# Altium schematic sheet LO_Synthetiser.SchDoc
size A4; SheetNumber: 1; SheetTotal: 4
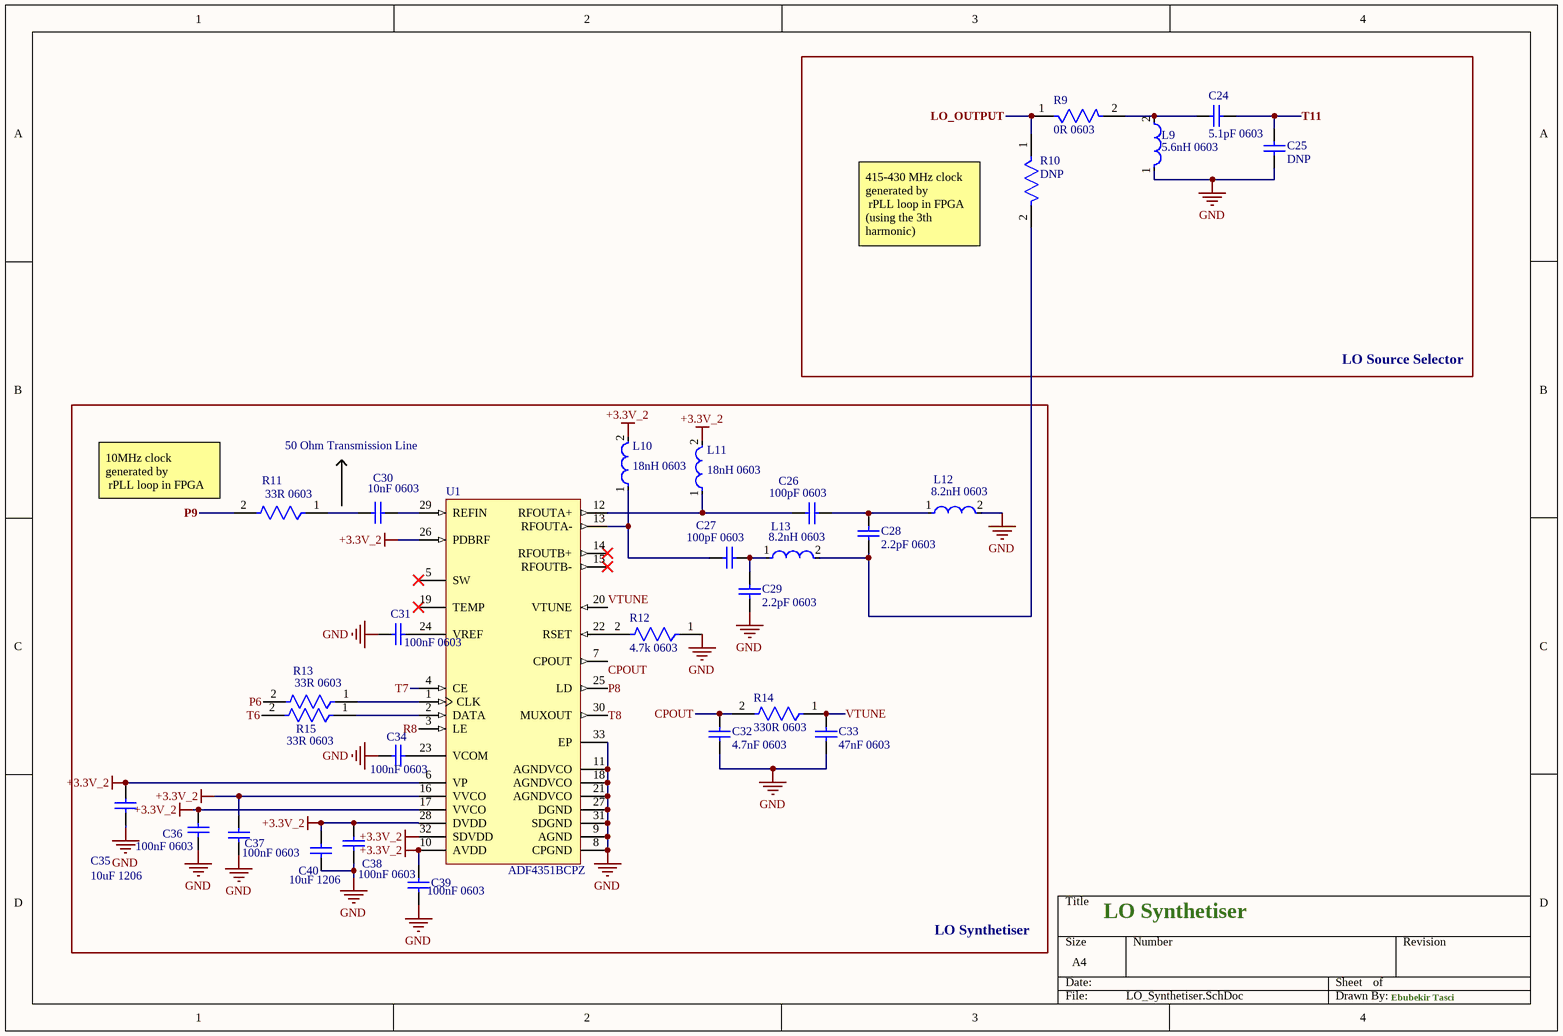
[diagram p0: LO_Synthetiser.SchDoc]

## Parts
C24  5.1pF 0603  [CAPC0603(1608)100_L]
C25  DNP  [CAPC0603(1608)100_L]
C26  100pF 0603  [CAPC1608X92X38LL15T08]
C27  100pF 0603  [CAPC1608X92X38LL15T08]
C28  2.2pF 0603  [CAPC0603(1608)100_L]
C29  2.2pF 0603  [CAPC0603(1608)100_L]
C30  10nF 0603  [CAPC0603(1608)100_L]
C31  100nF 0603  [CAPC0603(1608)100_L]
C32  4.7nF 0603  [CAPC0603(1608)100_L]
C33  47nF 0603  [CAPC0603(1608)100_L]
C34  100nF 0603  [CAPC0603(1608)100_L]
C35  10uF 1206  [CAPC1206(3216)190_M]
C36  100nF 0603  [CAPC0603(1608)100_L]
C37  100nF 0603  [CAPC0603(1608)100_L]
C38  100nF 0603  [CAPC0603(1608)100_L]
C39  100nF 0603  [CAPC0603(1608)100_L]
C40  10uF 1206  [CAPC1206(3216)190_M]
L9  5.6nH 0603  [FP-AISC-0603HP-MFG]
L10  18nH 0603  [FP-AISC-0603HP-MFG]
L11  18nH 0603  [FP-AISC-0603HP-MFG]
L12  8.2nH 0603  [FP-AISC-0603HP-MFG]
L13  8.2nH 0603  [FP-AISC-0603HP-MFG]
R9  0R 0603  [FP-CPF0603-MFG]
R10  DNP  [FP-CPF0603-MFG]
R11  33R 0603  [FP-CPF0603-MFG]
R12  4.7k 0603  [FP-CPF0603-MFG]
R13  33R 0603  [FP-CPF0603-MFG]
R14  330R 0603  [FP-CPF0603-MFG]
R15  33R 0603  [FP-CPF0603-MFG]
U1  ADF4351BCPZ  [ADI-CP-32-2_N]

## Blocks framed on the sheet
LO Source Selector: C24 C25 L9 R9 R10
LO Synthetiser: C26-C40 L10-L13 R11-R15 U1

## Nets
+3.3V_2: C35.1 C36.1 C37.1 C38.1 C39.1 C40.2 L10.2 L11.2 U1.6(VP) U1.10(AVDD) U1.16(VVCO) U1.17(VVCO) U1.26(PDBRF) U1.28(DVDD) U1.32(SDVDD)
GND: C25.1 C29.1 C31.2 C32.2 C33.2 C34.2 C35.2 C36.2 C37.2 C38.2 C39.2 C40.1 L9.1 L12.2 R12.1 U1.8(CPGND) U1.9(AGND) U1.11(AGNDVCO) U1.18(AGNDVCO) U1.21(AGNDVCO) U1.27(DGND) U1.31(SDGND) U1.33(EP)
CPOUT: C32.1 R14.2 U1.7(CPOUT)
LO_OUTPUT: R9.1 R10.1
P6: R13.2
P8: U1.25(LD)
P9: R11.2
R8: U1.3(LE)
T6: R15.2
T7: U1.4(CE)
T8: U1.30(MUXOUT)
T11: C24.2 C25.2
VTUNE: C33.1 R14.1 U1.20(VTUNE)
NetC24_1: C24.1 L9.2 R9.2
NetC26_1: C26.1 L11.1 U1.12(RFOUTA+)
NetC26_2: C26.2 C28.2 L12.1
NetC27_1: C27.1 L10.1 U1.13(RFOUTA-)
NetC27_2: C27.2 C29.2 L13.1
NetC28_1: C28.1 L13.2 R10.2
NetC30_1: C30.1 U1.29(REFIN)
NetC30_2: C30.2 R11.1
NetC31_1: C31.1 U1.24(VREF)
NetC34_1: C34.1 U1.23(VCOM)
NetR12_2: R12.2 U1.22(RSET)
NetR13_1: R13.1 U1.1(CLK)
NetR15_1: R15.1 U1.2(DATA)

Not connected (* = marked no-connect by the designer): U1 5(SW)* 14(RFOUTB+)* 15(RFOUTB-)* 19(TEMP)*

## Notes on the sheet
- (near R10) 415-430 MHz clock generated by
  rPLL loop in FPGA (using the 3th harmonic)
- 50 Ohm Transmission Line
- (near R11) 10MHz clock generated by
  rPLL loop in FPGA
- LO Synthetiser
- Ebubekir Tasci

## Library data of the parts
C24 = CMP-1035-00228-1: 0603 5.1pF; Case-EIA: 0603; Case-Metric: 1608; Max Thickness: 1 mm; Technology: SMT
C25 = CMP-1035-00228-1: 0603 Extra Pad; Case-EIA: 0603; Case-Metric: 1608; Max Thickness: 1 mm; Technology: SMT
C26 C27 = CMP-2006-01182-1: Manufacturer: Vitramon; Part Number: VJ0603A101FXAAC
C28 C29 = CMP-1035-00228-1: CAP 2.2pF 16V ±0.1pF 0603 (1608 Metric) Thickness 1mm SMD; Case-EIA: 0603; Tolerance: Â±0.1pF; Case-Metric: 1608; Max Thickness: 1 mm; Technology: SMT; Value: 2.2pF; Rated Voltage: 16 V
C30 = CMP-1035-00228-1: CAP 10nF 16V ±0.1pF 0603 (1608 Metric) Thickness 1mm SMD; Case-EIA: 0603; Tolerance: Â±0.1pF; Case-Metric: 1608; Max Thickness: 1 mm; Technology: SMT; Value: 10nF; Rated Voltage: 16 V
C31 C34 C36-C39 = CMP-1035-00228-1: CAP 100nF 16V ±0.1pF 0603 (1608 Metric) Thickness 1mm SMD; Case-EIA: 0603; Tolerance: Â±0.1pF; Case-Metric: 1608; Max Thickness: 1 mm; Technology: SMT; Value: 100nF; Rated Voltage: 16 V
C32 = CMP-1035-00228-1: CAP 4.7nF 16V ±0.1pF 0603 (1608 Metric) Thickness 1mm SMD; Case-EIA: 0603; Tolerance: Â±0.1pF; Case-Metric: 1608; Max Thickness: 1 mm; Technology: SMT; Value: 4.7nF; Rated Voltage: 16 V
C33 = CMP-1035-00228-1: CAP 47nF 16V ±0.1pF 0603 (1608 Metric) Thickness 1mm SMD; Case-EIA: 0603; Tolerance: Â±0.1pF; Case-Metric: 1608; Max Thickness: 1 mm; Technology: SMT; Value: 47nF; Rated Voltage: 16 V
C35 C40 = CMP-1037-04973-1: CAP 10uF 16V ±5% 1206 (3216 Metric) Thickness 1.9mm SMD; Case-EIA: 1206; Case-Metric: 3216; Tolerance: Â±5%; Rated Voltage: 16 V; Value: 10uF; Max Thickness: 1.9 mm; Technology: SMT
L9 = CMP-27750-000002-1: 5.6nH Wirewound 0603; Height - Seated (Max): 0.04inch; RoHS Compliant: Yes; Height: 1.02mm; Case Code (Metric): 1608; Package Quantity: 1; Packaging: Tape and Reel; Termination: SMD/SMT; Case Code (Imperial): 0603; Width: 1.12mm; Length: 0.071inch; Case/Package: 0603; Mount: Surface Mount
L10 L11 = CMP-27750-000002-1: 18nH Wirewound 0603; Height - Seated (Max): 0.04inch; RoHS Compliant: Yes; Height: 1.02mm; Case Code (Metric): 1608; Package Quantity: 1; Packaging: Tape and Reel; Termination: SMD/SMT; Case Code (Imperial): 0603; Width: 1.12mm; Length: 0.071inch; Case/Package: 0603; Mount: Surface Mount
L12 L13 = CMP-27750-000002-1: FIXED IND 8.2NH SMD; Shielding: Unshielded; Core Material: Ceramic; Tolerance: 5%; Height - Seated (Max): 0.04inch; RoHS Compliant: Yes; Height: 1.02mm; Case Code (Metric): 1608; Inductance: 8.2nH; Package Quantity: 1; Packaging: Tape and Reel; Min Operating Temperature: -40°C; Termination: SMD/SMT; Case Code (Imperial): 0603; Width: 1.12mm; Length: 0.071inch; Case/Package: 0603; Mount: Surface Mount
R9 = CMP-03211-006902-1: RES SMD 0Ω 0.1% 1/16W 0603; Manufacturer Part Number: CPF0603B430RE1; Manufacturer: TE Connectivity; Power Rating: 0.063W; Temperature Coefficient: 25ppm/°C; Voltage Rating: 50V; Lead Free: Yes; Temperature: -55°C to +155°C; Device Class L3: Chip SMD Resistors; RoHS: TRUE; packaging: 1k Reel; ComponentLink2Description: Datasheet; Category: Res; Resistance: 0Ω; Octopart: https://octopart.com/cpf0603b430re1-te+connectivity-22738753; Automotive: No; Height: 0.55mm; Package: CPF0603; octopart_url: https://octopart.com/cpf0603b430re1-te+connectivity-22738753; ComponentLink2URL: https://www.te.com/commerce/DocumentDelivery/DDEController?Action=showdoc&DocId=Data+Sheet%7F1773200%7FM%7Fpdf%7FEnglish%7FENG_DS_1773200_M.pdf%7F3-1676481-2; Series: CPF; Composition: Thin Film; Device Class L2: Resistors; Tolerance: 0.1%; Ipc Land Pattern Name: RESC15580X45; Value: 0Ω; Device Class L1: Passive Components; Temperature Range High: +155°C; Temperature Range Low: -55°C
R10 = CMP-03211-006902-1: Manufacturer Part Number: CPF0603B430RE1; Manufacturer: TE Connectivity; Resistance: 0Ω; Tolerance: 0.1%; Value: 0Ω; Power Rating: 0.063W; Temperature Coefficient: 25ppm/°C; Voltage Rating: 50V; Lead Free: Yes; Temperature: -55°C to +155°C; Device Class L3: Chip SMD Resistors; RoHS: TRUE; packaging: 1k Reel; ComponentLink2Description: Datasheet; Category: Res; Octopart: https://octopart.com/cpf0603b430re1-te+connectivity-22738753; Automotive: No; Height: 0.55mm; Package: CPF0603; octopart_url: https://octopart.com/cpf0603b430re1-te+connectivity-22738753; ComponentLink2URL: https://www.te.com/commerce/DocumentDelivery/DDEController?Action=showdoc&DocId=Data+Sheet%7F1773200%7FM%7Fpdf%7FEnglish%7FENG_DS_1773200_M.pdf%7F3-1676481-2; Series: CPF; Composition: Thin Film; Device Class L2: Resistors; Ipc Land Pattern Name: RESC15580X45; Device Class L1: Passive Components; Temperature Range High: +155°C; Temperature Range Low: -55°C
R11 R13 R15 = CMP-03211-006902-1: RES SMD 33Ω 0.1% 1/16W 0603; Manufacturer Part Number: CPF0603B430RE1; Manufacturer: TE Connectivity; Power Rating: 0.063W; Temperature Coefficient: 25ppm/°C; Voltage Rating: 50V; Lead Free: Yes; Temperature: -55°C to +155°C; Device Class L3: Chip SMD Resistors; RoHS: TRUE; packaging: 1k Reel; ComponentLink2Description: Datasheet; Category: Res; Resistance: 33Ω; Octopart: https://octopart.com/cpf0603b430re1-te+connectivity-22738753; Automotive: No; Height: 0.55mm; Package: CPF0603; octopart_url: https://octopart.com/cpf0603b430re1-te+connectivity-22738753; ComponentLink2URL: https://www.te.com/commerce/DocumentDelivery/DDEController?Action=showdoc&DocId=Data+Sheet%7F1773200%7FM%7Fpdf%7FEnglish%7FENG_DS_1773200_M.pdf%7F3-1676481-2; Series: CPF; Composition: Thin Film; Device Class L2: Resistors; Tolerance: 0.1%; Ipc Land Pattern Name: RESC15580X45; Value: 33Ω; Device Class L1: Passive Components; Temperature Range High: +155°C; Temperature Range Low: -55°C
R12 = CMP-03211-011109-1: RES SMD 4.7kΩ 0.1% 1/16W 0603; Manufacturer: TE Connectivity; Manufacturer Part Number: CPF0603B15RE; Power Rating: 0.063W; Temperature Coefficient: 25ppm/°C; Voltage Rating: 50V; Height: 0.55mm; Tolerance: 0.1%; Value: 4.7kΩ; Device Class L1: Passive Components; Temperature Range Low: -55°C; ComponentLink2Description: Datasheet; Device Class L3: Chip SMD Resistors; Package: CPF0603; Device Class L2: Resistors; Series: CPF; Temperature: -55°C to +155°C; packaging: 5k Reel; Temperature Range High: +155°C; Automotive: No; Composition: Thin Film; Ipc Land Pattern Name: RESC15580X45; RoHS: TRUE; ComponentLink2URL: https://www.te.com/commerce/DocumentDelivery/DDEController?Action=showdoc&DocId=Data+Sheet%7F1773200%7FM%7Fpdf%7FEnglish%7FENG_DS_1773200_M.pdf%7F3-1676481-2; Category: Res; Octopart: https://octopart.com/cpf0603b15re-te+connectivity-23283246; Lead Free: Yes; Resistance: 4.7kΩ; octopart_url: https://octopart.com/cpf0603b15re-te+connectivity-23283246
R14 = CMP-03211-011109-1: RES SMD 330Ω 0.1% 1/16W 0603; Manufacturer: TE Connectivity; Manufacturer Part Number: CPF0603B15RE; Power Rating: 0.063W; Temperature Coefficient: 25ppm/°C; Voltage Rating: 50V; Height: 0.55mm; Tolerance: 0.1%; Value: 330Ω; Device Class L1: Passive Components; Temperature Range Low: -55°C; ComponentLink2Description: Datasheet; Device Class L3: Chip SMD Resistors; Package: CPF0603; Device Class L2: Resistors; Series: CPF; Temperature: -55°C to +155°C; packaging: 5k Reel; Temperature Range High: +155°C; Automotive: No; Composition: Thin Film; Ipc Land Pattern Name: RESC15580X45; RoHS: TRUE; ComponentLink2URL: https://www.te.com/commerce/DocumentDelivery/DDEController?Action=showdoc&DocId=Data+Sheet%7F1773200%7FM%7Fpdf%7FEnglish%7FENG_DS_1773200_M.pdf%7F3-1676481-2; Category: Res; Octopart: https://octopart.com/cpf0603b15re-te+connectivity-23283246; Lead Free: Yes; Resistance: 330Ω; octopart_url: https://octopart.com/cpf0603b15re-te+connectivity-23283246
U1 = CMP-0287-00014-1: Wideband Synthesizer with Integrated VCO, CP-32-2, Pb-Free, 490 Tray; Norm Phase Noise (dBc/Hz): -221dBc; Single/Dual: Single; Supply Current: 110mA; Max REFin (MHz): 250MHz; Max RF Input (MHz): 4.4GHz; Frequency Range: 35MHz-4.4GHz; RF Prescalers: 4/5,8/9; ComponentLink2URL: http://www.analog.com/static/imported-files/data_sheets/ADF4351.pdf; ComponentLink1URL: www.analog.com; ComponentLink1Description: Manufacturer URL; PackageDescription: 32-Lead Lead Frame Chip Scale Package [LFCSP_VQ]; Code_JEDEC: MO-220-VHHD-2; DatasheetVersion: Rev. Pr D; ComponentLink3URL: http://www.analog.com/static/imported-files/packages/414143737956480539664569CP_32_2.pdf; PackageReference: CP-32-2; PackageVersion: Jan-2005; ComponentLink2Description: Datasheet; ComponentLink3Description: Package Specification